# EAGLE design driver1 (EAGLE 7.3.0)
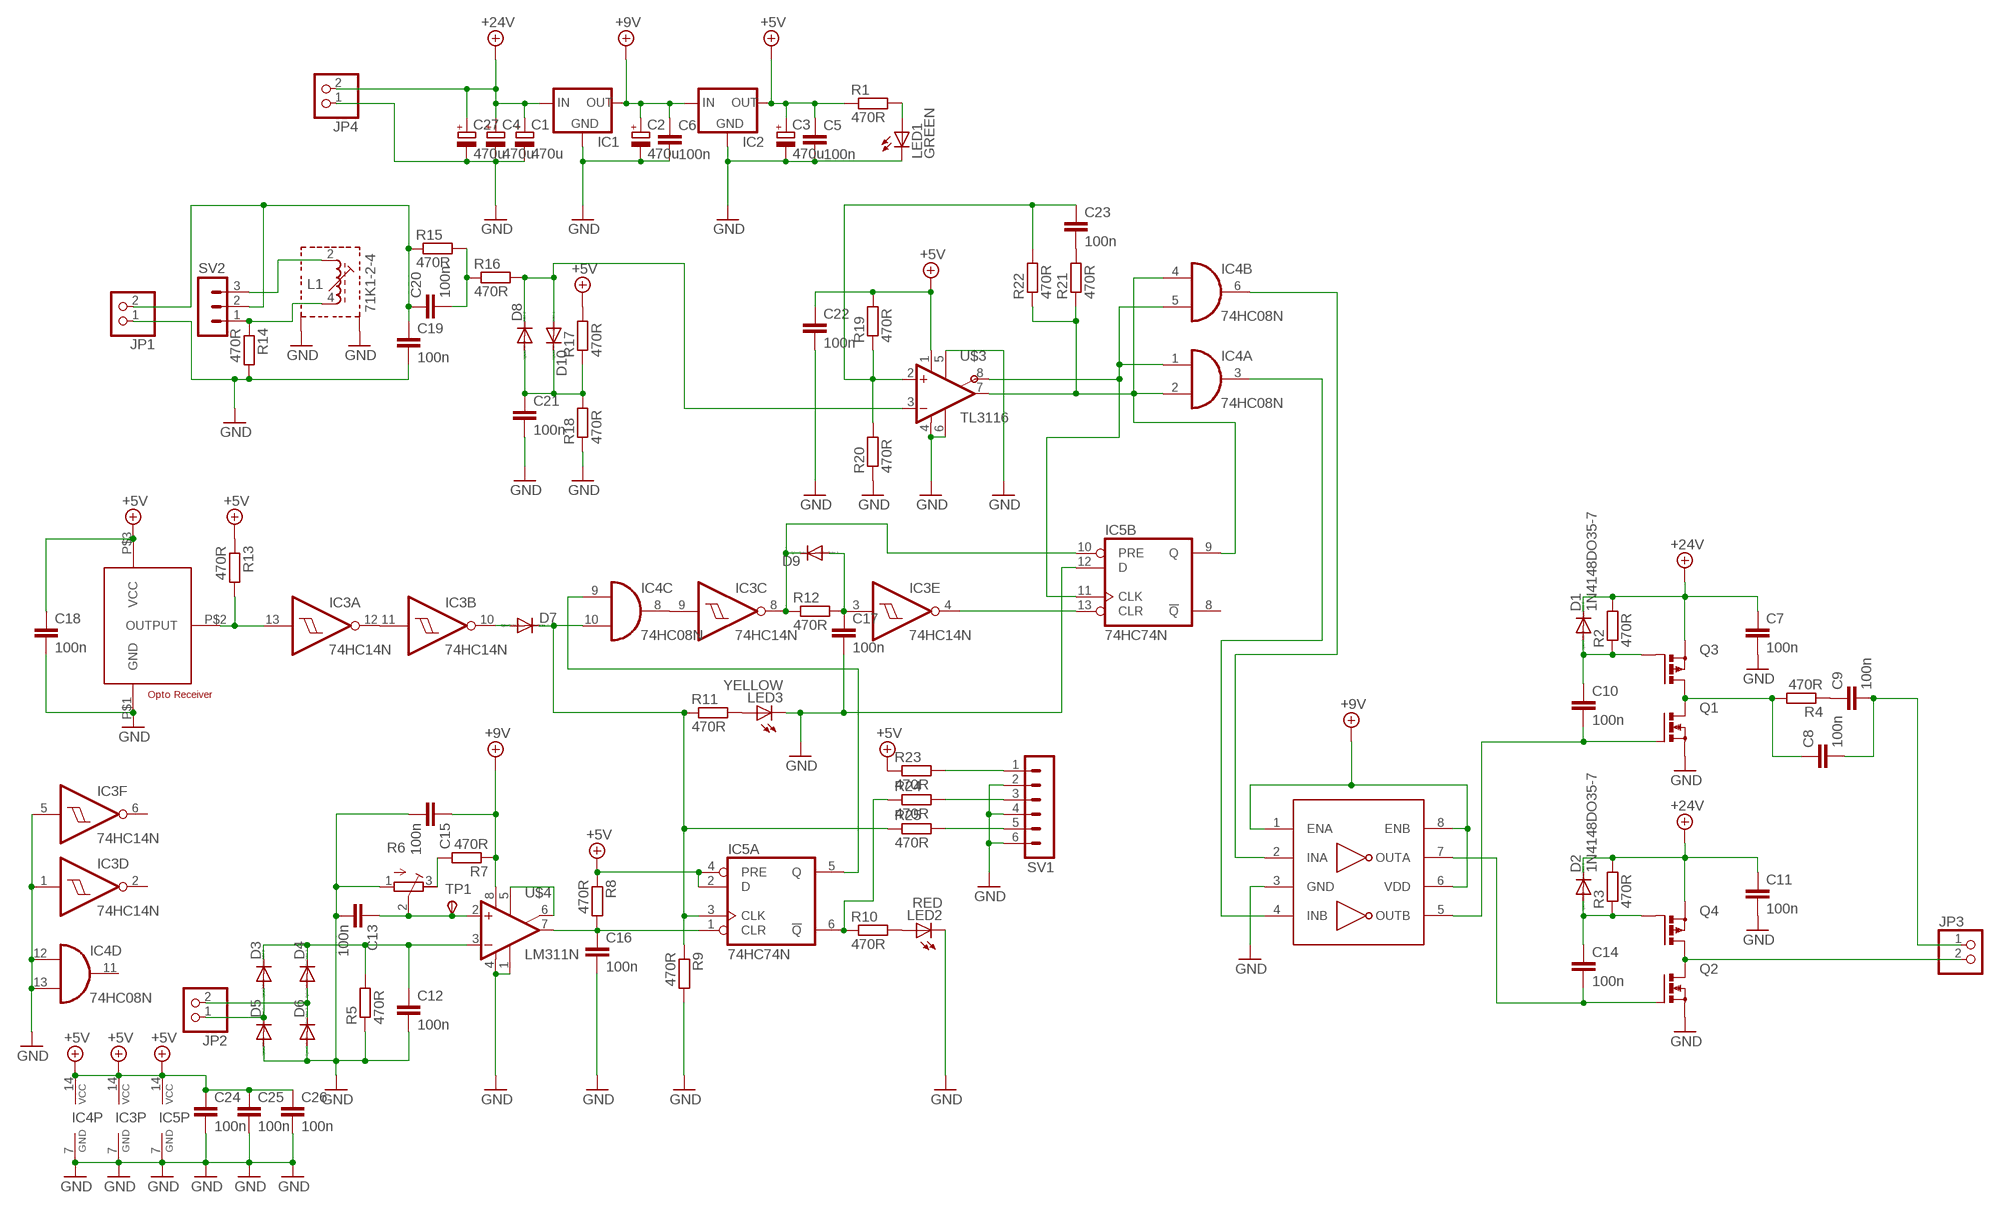
[diagram p0: schematic, sheet 1]

## Parts
C1  470u  CPOL-EUE5-8.5  [E5-8,5]
C2  470u  CPOL-EUE5-8.5  [E5-8,5]
C3  470u  CPOL-EUE5-8.5  [E5-8,5]
C4  470u  CPOL-EUE5-8.5  [E5-8,5]
C5  100n  C-EU025-025X050  [C025-025X050]
C6  100n  C-EU025-025X050  [C025-025X050]
C7  100n  C-EU025-025X050  [C025-025X050]
C8  100n  C-EU025-025X050  [C025-025X050]
C9  100n  C-EU025-025X050  [C025-025X050]
C10  100n  C-EU025-025X050  [C025-025X050]
C11  100n  C-EU025-025X050  [C025-025X050]
C12  100n  C-EU025-025X050  [C025-025X050]
C13  100n  C-EU025-025X050  [C025-025X050]
C14  100n  C-EU025-025X050  [C025-025X050]
C15  100n  C-EU025-025X050  [C025-025X050]
C16  100n  C-EU025-025X050  [C025-025X050]
C17  100n  C-EU025-025X050  [C025-025X050]
C18  100n  C-EU025-025X050  [C025-025X050]
C19  100n  C-EU025-025X050  [C025-025X050]
C20  100n  C-EU025-025X050  [C025-025X050]
C21  100n  C-EU025-025X050  [C025-025X050]
C22  100n  C-EU025-025X050  [C025-025X050]
C23  100n  C-EU025-025X050  [C025-025X050]
C24  100n  C-EU025-025X050  [C025-025X050]
C25  100n  C-EU025-025X050  [C025-025X050]
C26  100n  C-EU025-025X050  [C025-025X050]
C27  470u  CPOL-EUE5-8.5  [E5-8,5]
D1  1N4148DO35-7  [DO35-7]
D2  1N4148DO35-7  [DO35-7]
D3  DIODE-D-7.5  [D-7.5]
D4  DIODE-D-7.5  [D-7.5]
D5  DIODE-D-7.5  [D-7.5]
D6  DIODE-D-7.5  [D-7.5]
D7  DIODE-D-7.5  [D-7.5]
D8  DIODE-D-7.5  [D-7.5]
D9  DIODE-D-7.5  [D-7.5]
D10  DIODE-D-7.5  [D-7.5]
IC1  78XXS  [78XXS]
IC2  78XXS  [78XXS]
IC3  74HC14N  [DIL14]
IC4  74HC08N  [DIL14]
IC5  74HC74N  [DIL14]
JP1  PINHD-1X2  [1X02]
JP2  PINHD-1X2  [1X02]
JP3  PINHD-1X2  [1X02]
JP4  PINHD-1X2  [1X02]
L1  71K1-2-4  [71K]
LED1  GREEN  LED3MM  [LED3MM]
LED2  RED  LED3MM  [LED3MM]
LED3  YELLOW  LED3MM  [LED3MM]
Q1  PMOSFET_NTO220BV  [TO220BV]
Q2  PMOSFET_NTO220BV  [TO220BV]
Q3  PMOSFET_PTO220BV  [TO220BV]
Q4  PMOSFET_PTO220BV  [TO220BV]
R1  470R  R-EU_0207/7  [0207/7]
R2  470R  R-EU_0207/7  [0207/7]
R3  470R  R-EU_0207/7  [0207/7]
R4  470R  R-EU_0207/7  [0207/7]
R5  470R  R-EU_0309/12  [0309/12]
R6  R-TRIMM64W  [RTRIM64W]
R7  470R  R-EU_0207/7  [0207/7]
R8  470R  R-EU_0207/7  [0207/7]
R9  470R  R-EU_0207/7  [0207/7]
R10  470R  R-EU_0207/7  [0207/7]
R11  470R  R-EU_0207/7  [0207/7]
R12  470R  R-EU_0207/7  [0207/7]
R13  470R  R-EU_0207/7  [0207/7]
R14  470R  R-EU_0207/7  [0207/7]
R15  470R  R-EU_0207/7  [0207/7]
R16  470R  R-EU_0207/7  [0207/7]
R17  470R  R-EU_0207/7  [0207/7]
R18  470R  R-EU_0207/7  [0207/7]
R19  470R  R-EU_0207/7  [0207/7]
R20  470R  R-EU_0207/7  [0207/7]
R21  470R  R-EU_0207/7  [0207/7]
R22  470R  R-EU_0207/7  [0207/7]
R23  470R  R-EU_0207/7  [0207/7]
R24  470R  R-EU_0207/7  [0207/7]
R25  470R  R-EU_0207/7  [0207/7]
SV1  MA06-1  [MA06-1]
SV2  MA03-1  [MA03-1]
TP1  TPSTP20R  [TP20R]
U$1  UCC27423  [DIL8]
U$2  IFD95  [OPTO-RECEIVER]
U$3  TL3116  [DIL8]
U$4  LM311N  [DIL8]

## Nets
+5V: C3.+ C5.1 C18.1 C22.1 C24.1 C25.1 C26.1 IC2.OUT IC3.14(P:VCC) IC4.14(P:VCC) IC5.2(A:D) IC5.4(A:PRE) IC5.14(P:VCC) R1.1 R8.1 R13.1 R17.2 R19.2 R23.1 U$2.P$3(VCC) U$3.1(V+)
+9V: C2.+ C6.1 C15.1 IC1.OUT IC2.IN R7.1 U$1.1(ENA) U$1.6(VDD) U$1.8(ENB) U$4.8(V+)
+24V: C1.+ C4.+ C7.1 C11.1 C27.+ D1.C D2.C IC1.IN JP4.2 Q3.S Q4.S R2.2 R3.2
GND: C1.- C2.- C3.- C4.- C5.2 C6.2 C7.2 C11.2 C12.2 C13.2 C15.2 C16.2 C17.2 C18.2 C19.2 C21.2 C22.2 C24.2 C25.2 C26.2 C27.- D5.A D6.A IC1.GND IC2.GND IC3.1(D:I) IC3.5(F:I) IC3.7(P:GND) IC4.7(P:GND) IC4.12(D:I0) IC4.13(D:I1) IC5.7(P:GND) IC5.12(B:D) JP1.1 JP4.1 L1.S1 L1.S2 LED1.K(C) LED2.K(C) LED3.K(C) Q1.S Q2.S R5.1 R6.1(A) R9.2 R14.2 R18.1 R20.1 SV1.2 SV1.4 SV1.6 U$1.3(GND) U$2.P$1(GND) U$3.4(V-) U$3.5(LEN) U$3.6(GND) U$4.1(GND) U$4.4(V-)
N$1: IC3.11(B:I) IC3.12(A:O)
N$2: LED1.A R1.2
N$3: IC3.9(C:I) IC4.8(C:O)
N$4: C8.1 Q1.D Q3.D R4.2
N$5: U$4.5(ON) U$4.6(ON/STR)
N$6: C10.1 D1.A Q3.G R2.1
N$7: IC4.2(A:I1) IC4.4(B:I0) IC5.9(B:Q) R21.1 R22.1 U$3.7(OUT)
N$8: C9.1 R4.1
N$9: C8.2 C9.2 JP3.1
N$10: C14.1 D2.A Q4.G R3.1
N$11: IC4.6(B:O) U$1.2(INA)
N$12: JP3.2 Q2.D Q4.D
N$13: C16.1 IC5.1(A:CLR) R8.2 U$4.7(OUT)
N$14: R6.3(E) R7.2
N$15: R23.2 SV1.1
N$16: R24.2 SV1.3
N$17: IC4.3(A:O) U$1.4(INB)
N$18: R25.2 SV1.5
N$19: C13.1 R6.2(S) TP1.TP(PP) U$4.2(+IN)
N$20: C12.1 D3.C D4.C R5.2 U$4.3(-IN)
N$22: D9.C IC3.8(C:O) IC5.10(B:PRE) R12.1
N$23: D3.A D5.C JP2.1
N$24: D4.A D6.C JP2.2
N$25: D7.C IC4.10(C:I1) IC5.3(A:CLK) R9.1 R11.1 R25.1
N$26: IC3.13(A:I) R13.2 U$2.P$2(OUTPUT)
N$27: D7.A IC3.10(B:O)
N$28: IC5.6(A:!Q) R10.1 R24.1
N$29: LED2.A R10.2
N$30: LED3.A R11.2
N$31: IC4.9(C:I0) IC5.5(A:Q)
N$32: C17.1 D9.A IC3.3(E:I) R12.2
N$33: IC3.4(E:O) IC5.13(B:CLR)
N$34: IC4.1(A:I0) IC4.5(B:I1) IC5.11(B:CLK) U$3.8(!OUT)
N$35: C19.1 C20.1 JP1.2 R15.1 SV2.2
N$36: C14.2 Q2.G U$1.7(OUTA)
N$37: C20.2 R15.2 R16.1
N$38: L1.4(E) R14.1 SV2.1
N$39: L1.2(A) SV2.3
N$40: D8.C D10.A R16.2 U$3.3(-IN)
N$41: C21.1 D8.A D10.C R17.1 R18.2
N$42: C10.2 Q1.G U$1.5(OUTB)
N$46: C23.2 R21.2
N$47: C23.1 R19.1 R20.2 R22.2 U$3.2(+IN)
Unconnected: IC3.2(D:O) IC3.6(F:O) IC4.11(D:O) IC5.8(B:!Q)

## Library data of the parts
C1-C4 C27 = rcl:CPOL-EU: POLARIZED CAPACITOR, European symbol
C5-C26 = rcl:C-EU: CAPACITOR, European symbol
D1 D2 = diode:1N4148: DIODE high speed (Philips)
D3-D10 = diode:DIODE-: DIODE
IC1 IC2 = v-reg:78XXS: VOLTAGE REGULATOR
IC3 = 74xx-eu:74*14: Hex schmitt trigger INVERTER
IC4 = 74xx-eu:74*08: Quad 2-input AND gate
IC5 = 74xx-eu:74*74: Dual D type positive edge triggered FLIP FLOP, preset and clear
JP1-JP4 = pinhead:PINHD-1X2: PIN HEADER
L1 = UD27:71K1-: FILTER adjustable filter coil, type K; OC_FARNELL: unknown; OC_NEWARK: unknown
LED1-LED3 = led:LED: LED OSRAM: - CHIPLED LG R971, LG N971, LY N971, LG Q971, LY Q971, LO R971, LY R971 LH N974, LH R974 LS Q976, LO Q976, LY Q976 LO Q996 - Hyper CHIPLED LW Q18S LB Q993, LB Q99A, LB R99A - SideLED LS A670, LO A670, LY A670, LG A670, LP A670 LB A673, LV A673, LT A673, LW A673 LH A674 LY A675 LS A676, LA A676, LO A676, LY A676, LW A676 LS A679, LY A679, LG A679 - Hyper Micro SIDELED® LS Y876, LA Y876, LO Y876, LY Y876 LT Y87S - SmartLED LW L88C, LW L88S LB L89C, LB L89S, LG L890 LS L89K, LO L89K, LY L89K LS L896, LA L896, LO L896, LY L896 - TOPLED LS T670, LO T670, LY T670, LG T670, LP T670 LSG T670, LSP T670, LSY T670, LOP T670, LYG T670 LG T671, LOG T671, LSG T671 LB T673, LV T673, LT T673, LW T673 LH T674 LS T676, LA T676, LO T676, LY T676, LB T676, LH T676, LSB T676, LW T676 LB T67C, LV T67C, LT T67C, LS T67K, LO T67K, LY T67K, LW E67C LS E67B, LA E67B, LO E67B, LY E67B, LB E67C, LV E67C, LT E67C LW T67C LS T679, LY T679, LG T679 LS T770, LO T770, LY T770, LG T770, LP T770 LB T773, LV T773, LT T773, LW T773 LH T774 LS E675, LA E675, LY E675, LS T675 LS T776, LA T776, LO T776, LY T776, LB T776 LHGB T686 LT T68C, LB T68C - Hyper Mini TOPLED® LB M676 - Mini TOPLED Santana® LG M470 LS M47K, LO M47K, LY M47K Source: http://www.osram.convergy.de LUXEON: - LUMILED® LXK2-PW12-R00, LXK2-PW12-S00, LXK2-PW14-U00, LXK2-PW14-V00 LXK2-PM12-R00, LXK2-PM12-S00, LXK2-PM14-U00 LXK2-PE12-Q00, LXK2-PE12-R00, LXK2-PE12-S00, LXK2-PE14-T00, LXK2-PE14-U00 LXK2-PB12-K00, LXK2-PB12-L00, LXK2-PB12-M00, LXK2-PB14-N00, LXK2-PB14-P00, LXK2-PB14-Q00 LXK2-PR12-L00, LXK2-PR12-M00, LXK2-PR14-Q00, LXK2-PR14-R00 LXK2-PD12-Q00, LXK2-PD12-R00, LXK2-PD12-S00 LXK2-PH12-R00, LXK2-PH12-S00 LXK2-PL12-P00, LXK2-PL12-Q00, LXK2-PL12-R00 Source: www.luxeon.com KINGBRIGHT: KA-3528ASYC Source: www.kingbright.com
Q1 Q2 = transistor-power:PMOSFET_N: Power MOSFET N-Channel
Q3 Q4 = transistor-power:PMOSFET_P: Power MOSFET P-Channel
R1-R5 R7-R25 = rcl:R-EU_: RESISTOR, European symbol
R6 = rcl:R-TRIMM: Trimm resistor
SV1 = con-lstb:MA06-1: PIN HEADER; OC_FARNELL: unknown; OC_NEWARK: unknown
SV2 = con-lstb:MA03-1: PIN HEADER; OC_FARNELL: unknown; OC_NEWARK: unknown
TP1 = testpad:TPS: TEST PIN
U$1 = driver:UCC27423
U$2 = BillPorter:IFD95: IF-D95T Photologic Detector with Totem-Pole Output. Fiber Optic Receiver with push-pull output. May also work with IF-D97 and IF-D98 receivers. Spec sheet @ http://www.i-fiberoptics.com/pdf/IFD95.pdf
U$3 = driver:TL3116
U$4 = driver:LM311N

## Board
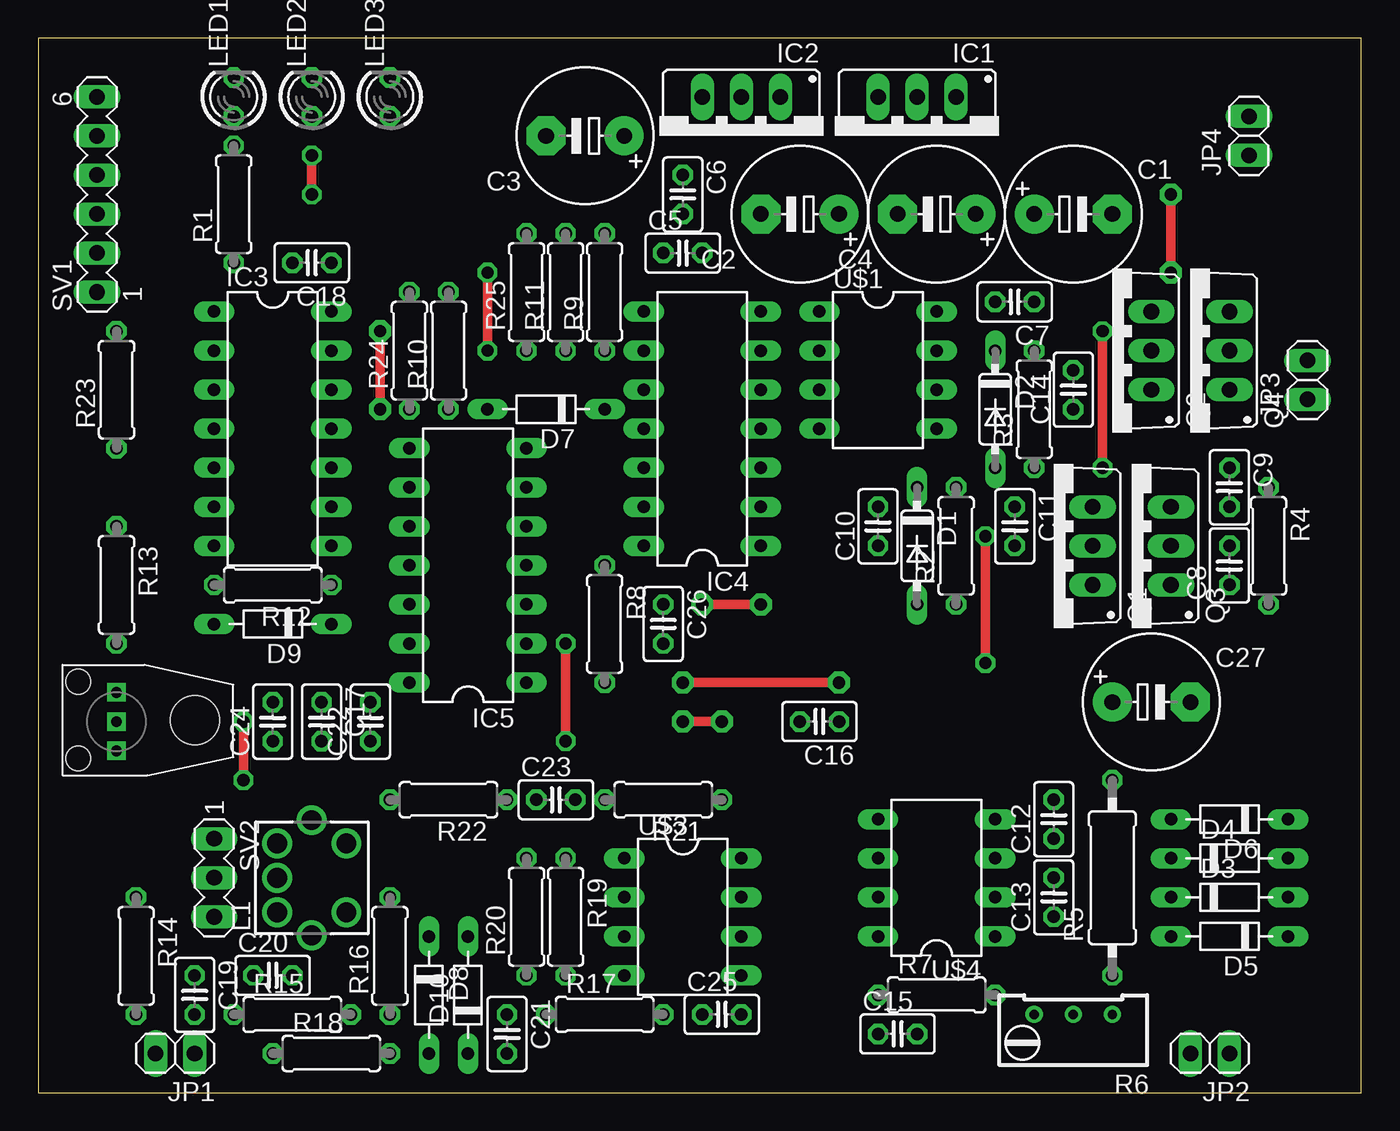
[diagram p1: board, top side]
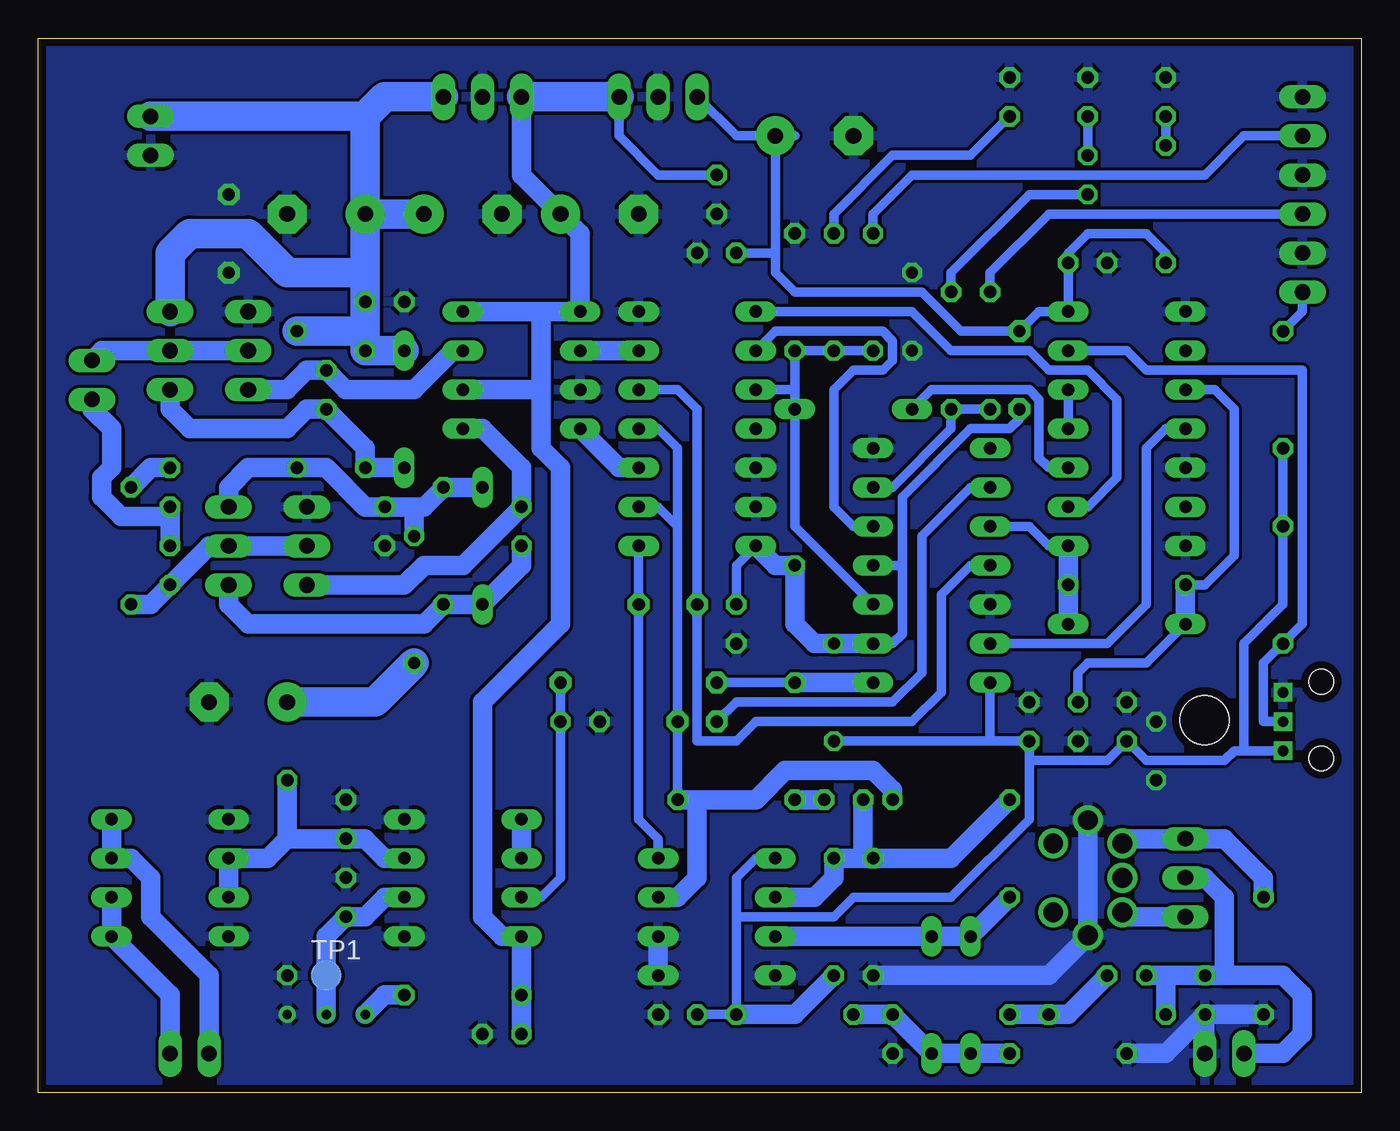
[diagram p2: board, bottom side, seen from below]

Size 86.03 x 68.57 mm. Coordinates in mm from the lower left corner, seen from the top.
Outline: 0,0 86.03,0 86.03,68.57 0,68.57 0,0
Copper layers (1*16): Top 0.035mm / dielectric 1.5mm / Bottom 0.035mm
Design rules "default *": minimum track width 10mil, minimum drill 24mil, track to track 8mil, track to pad 8mil, pad to pad 8mil, via to via 8mil, smd to smd 8mil, copper to edge 20mil, drill to drill 8mil, minimum pad ring 10mil, minimum via ring 8mil, stop-mask expansion 4mil, vias tented up to drill 0mil, thermal gap 10mil

### Footprints (pad centres in the part's own frame; a part is rotated, then mirrored left to right if it is on the bottom)
E5-8,5 = drill 1.016 pad 2.54: + -2.54,0 | drill 1.016 pad 2.54 octagon: - 2.54,0
C025-025X050 = drill 0.813 octagon: 1 -1.27,0; 2 1.27,0
DO35-7 = drill 0.813 long: A 3.81,0; C -3.81,0
D-7.5 = drill 0.813 long: A 3.81,0; C -3.81,0
78XXS = drill 1.016 long: GND 0,-2.54; IN -2.54,-2.54; OUT 2.54,-2.54
DIL14 = drill 0.813 long: 1 -7.62,-3.81; 2 -5.08,-3.81; 3 -2.54,-3.81; 4 0,-3.81; 5 2.54,-3.81; 6 5.08,-3.81; 7 7.62,-3.81; 8 7.62,3.81; 9 5.08,3.81; 10 2.54,3.81; 11 0,3.81; 12 -2.54,3.81; 13 -5.08,3.81; 14 -7.62,3.81
1X02 = drill 1.016 long: 1 -1.27,0; 2 1.27,0
71K = drill 1.3: 1 -2.25,-2.25; 2 -2.25,2.25; 3 0,2.25; 4 2.25,2.25; 5 2.25,-2.25; S1 -3.75,0; S2 3.75,0
LED3MM = drill 0.813 octagon: A -1.27,0; K 1.27,0
TO220BV = drill 1.016 long: D 0,-2.54; G -2.54,-2.54; S 2.54,-2.54
0207/7 = drill 0.813 octagon: 1 -3.81,0; 2 3.81,0
0309/12 = drill 0.813 octagon: 1 -6.35,0; 2 6.35,0
RTRIM64W = drill 0.61: 1 1.27,-2.54; 2 1.27,0; 3 1.27,2.54
MA06-1 = drill 1.016 long: 1 -6.35,0; 2 -3.81,0; 3 -1.27,0; 4 1.27,0; 5 3.81,0; 6 6.35,0
MA03-1 = drill 1.016 long: 1 -2.54,0; 2 0,0; 3 2.54,0
TP20R = smd 2 x 2: TP 0,0
DIL8 = drill 0.813 long: 1 -3.81,-3.81; 2 -1.27,-3.81; 3 1.27,-3.81; 4 3.81,-3.81; 5 3.81,3.81; 6 1.27,3.81; 7 -1.27,3.81; 8 -3.81,3.81
OPTO-RECEIVER = drill 0.7 square: P$1 1.9,0; P$2 0,0; P$3 -1.9,0 | hole 1.6: -2.4,2.5; 2.6,2.5 | hole 3.2: 0.1,-5.1

### Placement (x,y rotation side)
C1  67.31,57.15 0 top
C2  49.53,57.15 180 top
C3  35.56,62.23 180 top
C4  58.42,57.15 180 top
C5  41.91,54.61 0 top
C6  41.91,58.42 270 top
C7  63.5,51.44 180 top
C8  77.47,34.29 90 top
C9  77.47,39.37 270 top
C10  54.61,36.83 90 top
C11  63.5,36.83 270 top
C12  66.04,17.78 90 top
C13  66.04,12.7 90 top
C14  67.31,45.72 90 top
C15  55.88,3.81 0 top
C16  50.8,24.13 180 top
C17  18.41,24.13 270 top
C18  17.78,53.98 180 top
C19  10.16,6.35 270 top
C20  15.24,7.62 0 top
C21  30.48,3.81 270 top
C22  21.59,24.13 90 top
C23  33.66,19.05 0 top
C24  15.24,24.13 90 top
C25  44.45,5.08 0 top
C26  40.64,30.48 270 top
C27  72.39,25.4 0 top
D1  57.15,35.56 270 top
D2  62.23,44.45 270 top
D3  77.47,12.7 0 top
D4  77.47,15.24 0 top
D5  77.47,10.16 180 top
D6  77.47,17.78 180 top
D7  33.02,44.45 180 top
D8  25.4,6.35 270 top
D9  15.24,30.48 180 top
D10  27.94,6.35 90 top
IC1  57.15,62.23 180 top
IC2  45.72,62.23 180 top
IC3  15.24,43.18 270 top
IC4  43.18,43.18 90 top
IC5  27.94,34.29 90 top
JP1  8.89,2.54 180 top
JP2  76.2,2.54 180 top
JP3  82.55,46.35 90 top
JP4  78.74,62.23 90 top
L1  17.78,13.97 90 top
LED1  12.7,64.77 90 top
LED2  17.78,64.77 90 top
LED3  22.86,64.77 90 top
Q1  66.04,35.56 90 top
Q2  69.85,48.26 90 top
Q3  71.12,35.56 90 top
Q4  74.93,48.26 90 top
R1  12.7,57.78 90 top
R2  59.69,35.56 90 top
R3  64.77,44.45 90 top
R4  80.01,35.56 270 top
R5  69.85,13.97 90 top
R6  67.31,3.81 90 top
R7  58.42,6.35 0 top
R8  36.83,30.48 270 top
R9  36.83,52.07 90 top
R10  26.67,48.26 90 top
R11  34.29,52.07 90 top
R12  15.24,33.02 180 top
R13  5.08,33.02 270 top
R14  6.35,8.89 270 top
R15  16.51,5.08 0 top
R16  22.86,8.89 90 top
R17  36.83,5.08 0 top
R18  19.05,2.54 0 top
R19  34.29,11.43 270 top
R20  31.75,11.43 90 top
R21  40.64,19.05 180 top
R22  26.67,19.05 180 top
R23  5.08,45.72 90 top
R24  24.13,48.26 90 top
R25  31.75,52.07 90 top
SV1  3.81,58.42 90 top
SV2  11.43,13.97 270 top
TP1  67.31,7.62 0 bottom
U$1  54.61,46.99 270 top
U$2  5.08,24.13 90 top
U$3  41.91,11.43 270 top
U$4  58.42,13.97 90 top

### Tracks (layer width: path | path; a pad name or v marks a point on that pad's centre or on a via)
+5V  (via drill 0.8 pad 1.27, 0.8 pad 1.42)
  Top 0.61: v22.23,49.53 v22.23,44.45 | v34.29,22.86 v34.29,29.21
  Bottom 0.61: 40.64,11.43 R17.2 C25.1 | 40.64,11.43 34.29,11.43 33.02,12.7 26.67,12.7 21.59,17.78 21.59,21.59 | U$3.1 39.37,15.24 40.64,13.97 40.64,11.43 | IC5.4 29.84,34.29 | 29.84,34.29 29.84,29.84 30.48,29.21 IC5.2 | 29.84,34.29 29.84,38.73 25.4,43.18 22.86,43.18 22.23,43.81 v22.23,44.45 | 36.83,62.23 C3.+ | C3.+ 40.64,62.23 IC2.OUT | 38.1,54.61 38.1,53.34 36.83,52.07 28.57,52.07 26.04,49.53 v22.23,49.53 20.95,50.8 IC3.14 C18.1 19.05,54.61 17.78,55.88 13.97,55.88 12.7,54.61 R1.1 | 21.59,21.59 C22.1 24.13,22.86 | C26.1 40.64,34.29 IC4.14 | C5.1 38.1,54.61 | 24.13,22.86 v34.29,22.86 | IC5.14 24.13,22.86 | U$2.P$3 7.62,22.23 | 7.62,22.23 8.25,22.23 8.89,21.59 13.97,21.59 C24.1 16.51,21.59 21.59,21.59 | 7.62,22.23 7.62,29.21 5.08,31.75 R13.1 R23.1 | 38.1,54.61 C3.+
  Bottom 1.27: R19.2 36.83,5.08 R17.2 | IC4.14 38.1,34.29 R8.1 36.83,30.48 35.56,29.21 v34.29,29.21 IC5.2
+9V
  Bottom 0.61: C6.1 45.72,59.69 48.26,62.23 IC2.IN
  Bottom 1.27: C15.1 R7.1 U$4.8 55.88,10.16 57.15,11.43 57.15,25.4 52.07,30.48 52.07,40.64 53.34,41.91 53.34,45.72 | 53.34,50.8 U$1.1 50.8,55.88 C2.+ 54.61,59.69 IC1.OUT | 53.34,50.8 U$1.8 | U$1.6 53.34,45.72 | 53.34,45.72 53.34,50.8
  Bottom 1.93: IC1.OUT IC2.IN
+24V  (via drill 0.8 pad 1.27)
  Top 0.61: v69.22,40.64 v69.22,49.53 | v61.59,27.94 v61.59,36.2
  Bottom 1.27: D1.C R2.2 60.96,38.1 61.59,38.1 | Q3.S 73.66,39.37 72.39,40.64 v69.22,40.64 67.31,40.64 64.77,38.1 C11.1 61.59,38.1 | v61.59,36.2 61.59,38.1
  Bottom 1.93: JP4.2 64.77,63.5 | 64.77,63.5 63.5,64.77 IC1.IN | Q4.S 77.47,54.61 76.2,55.88 72.39,55.88 69.85,53.34 64.77,53.34 | C4.+ C1.+ | 64.77,63.5 C1.+ | C1.+ 64.77,53.34 | 64.77,53.34 C7.1 64.77,49.53 | 64.77,49.53 R3.2 D2.C | v69.22,49.53 64.77,49.53 | C27.+ 64.14,25.4 v61.59,27.94
GND  (via drill 0.8 pad 1.27, 0.8 pad 1.42)
  Top 0.61: v73.66,53.34 v73.66,58.42 | v13.34,24.13 v13.34,20.32 | v29.21,48.26 v29.21,53.34
  Bottom 1.27: L1.S2 L1.S1 17.78,10.16 20.32,7.62 R20.1 | U$3.6 U$3.5 | C19.2 12.7,2.54 R18.1 | R14.2 C19.2 | JP1.1 C19.2
  pour Bottom: 0,0 86.36,0 86.36,68.58 0,68.58
N$1
  Bottom 0.61: IC3.12 IC3.11
N$2
  Bottom 0.61: R1.2 LED1.A
N$3
  Bottom 0.61: IC4.8 29.21,50.8 26.67,48.26 21.59,48.26 20.32,46.99 17.78,46.99 15.88,45.09 15.88,40.01 17.78,38.1 IC3.9
N$4
  Bottom 1.27: Q1.D Q3.D 74.93,35.56 C8.1 78.74,31.75 R4.2
N$5
  Bottom 1.27: U$4.5 U$4.6
N$6
  Bottom 1.27: C10.1 54.61,34.29 D1.A R2.1 60.96,30.48 72.39,30.48 73.66,31.75 Q3.G
N$7  (via drill 0.8 pad 1.42)
  Top 0.61: v41.91,24.13 v44.45,24.13
  Bottom 0.61: 44.45,36.83 45.72,38.1 IC4.2 | IC4.4 45.72,43.18 44.45,41.91 44.45,36.83 | IC5.9 25.4,39.37 28.57,36.2 28.57,27.3 30.48,25.4 40.64,25.4 v41.91,24.13 | R21.1 v44.45,24.13 44.45,36.83
  Bottom 1.27: U$3.7 44.45,12.7 43.18,13.97 43.18,19.05 | 43.18,19.05 R21.1 | R22.1 30.48,19.68 31.75,20.95 37.47,20.95 39.37,19.05 43.18,19.05
N$8
  Bottom 1.27: C9.1 78.74,40.64 R4.1
N$9
  Bottom 1.27: C8.2 77.47,37.47 | 77.47,37.47 C9.2 | JP3.1 82.55,44.45 81.28,43.18 81.28,40.64 81.92,40.01 81.92,38.73 80.64,37.47 77.47,37.47
N$10
  Bottom 1.27: D2.A R3.1 64.77,41.91 C14.1 68.58,44.45 69.85,43.18 76.2,43.18 77.47,44.45 Q4.G
N$11
  Bottom 1.27: U$1.2 IC4.6
N$12
  Bottom 1.27: Q2.D Q4.D 81.92,48.26 JP3.2
N$13  (via drill 0.8 pad 1.42)
  Top 0.61: v41.91,26.67 v52.07,26.67
  Bottom 0.61: R8.2 v41.91,26.67 | U$4.7 53.34,12.7 52.07,13.97 C16.1 v52.07,26.67
  Bottom 1.27: R8.2 IC5.1
N$14
  Bottom 1.27: R7.2 63.5,6.35 R6.3
N$15
  Bottom 0.61: SV1.1 3.81,50.8 R23.2
N$16
  Bottom 0.61: SV1.3 20.32,57.15 24.13,53.34 R24.2
N$17
  Bottom 1.27: U$1.4 48.26,40.64 IC4.3
N$18
  Bottom 0.61: R25.2 31.75,57.15 29.21,59.69 10.16,59.69 7.62,62.23 SV1.5
N$19
  Bottom 1.27: U$4.2 63.5,12.7 64.77,11.43 C13.1 67.31,10.16 TP1.TP R6.2
N$20
  Bottom 1.27: D3.C D4.C 71.12,15.24 69.85,16.51 | 69.85,16.51 R5.2 | U$4.3 63.5,15.24 64.77,16.51 C12.1 69.85,16.51
N$22
  Bottom 0.61: IC3.8 20.32,35.56 21.59,36.83 IC5.10
  Bottom 1.27: D9.C R12.1 IC3.8
N$23
  Bottom 1.27: D3.A D5.C 77.47,6.35 JP2.1
N$24
  Bottom 1.27: D6.C D4.A 80.01,15.24 78.74,13.97 78.74,11.43 74.93,7.62 JP2.2
N$25
  Bottom 0.61: 36.83,45.72 D7.C 36.83,36.83 IC5.3 | 36.83,45.72 R9.1 R11.1 R25.1 | IC4.10 36.83,45.72
N$26
  Bottom 0.61: IC3.13 15.24,48.26 13.97,46.99 3.81,46.99 3.81,30.48 R13.2 6.35,27.94 6.35,24.13 U$2.P$2
N$27
  Bottom 0.61: IC3.10 20.32,40.64 20.95,41.27 20.95,45.09 21.59,45.72 27.94,45.72 D7.A
N$28
  Bottom 0.61: IC5.6 30.48,39.37 26.67,43.18 R10.1 R24.1
N$29  (via drill 0.8 pad 1.27)
  Top 0.61: v17.78,58.42 v17.78,60.96
  Bottom 0.61: R10.2 26.67,53.34 21.59,58.42 v17.78,58.42 | v17.78,60.96 LED2.A
N$30
  Bottom 0.61: R11.2 34.29,57.15 30.48,60.96 25.4,60.96 LED3.A
N$31
  Bottom 0.61: IC4.9 38.1,49.53 31.11,49.53 30.48,48.9 30.48,47.62 31.11,46.99 33.02,46.99 34.29,45.72 34.29,38.1 33.02,36.83 IC5.5
N$32
  Bottom 0.61: R12.2 10.16,33.02 8.26,34.92 8.26,44.45 9.53,45.72 IC3.3 | C17.1 18.41,27.3 17.78,27.94 13.97,27.94 D9.A
  Bottom 1.27: D9.A R12.2
N$33
  Bottom 0.61: IC5.13 16.51,29.21 13.97,31.75 13.97,41.91 12.7,43.18 IC3.4
N$34  (via drill 0.8 pad 1.42)
  Top 0.61: v43.18,31.75 v46.99,31.75
  Bottom 0.61: IC5.11 25.4,34.29 27.3,32.38 27.3,26.04 29.21,24.13 39.37,24.13 40.64,22.86 43.18,22.86 v43.18,31.75 43.18,44.45 44.45,45.72 IC4.5 | IC4.1 v46.99,31.75 46.99,17.78 45.72,16.51 U$3.8
N$35
  Bottom 1.27: 8.89,7.62 C19.1 12.7,7.62 | 12.7,7.62 C20.1 | R15.1 12.7,7.62 | SV2.2 10.16,13.97 8.89,12.7 8.89,7.62 | 8.89,7.62 5.08,7.62 3.81,6.35 3.81,3.81 5.08,2.54 JP1.2
N$36
  Bottom 1.27: Q2.G 69.85,45.72 68.58,46.99 C14.2 66.04,45.72 61.59,45.72 59.05,48.26 U$1.7
N$37
  Bottom 1.27: C20.2 19.05,5.08 R15.2 R16.1
N$38
  Bottom 1.27: L1.4 15.24,16.51 SV2.1 8.89,16.51 6.35,13.97 R14.1
N$39
  Bottom 1.27: SV2.3 15.24,11.43 L1.2
N$40
  Bottom 1.27: R16.2 D8.C D10.A U$3.3
N$41
  Bottom 1.27: R18.2 D8.A D10.C C21.1 R17.1
N$42
  Bottom 1.27: U$1.5 57.15,43.18 54.61,40.64 C10.2 58.42,34.29 60.96,34.29 62.23,33.02 Q1.G
N$46
  Bottom 1.27: R21.2 C23.2
N$47
  Bottom 1.27: U$3.2 35.56,12.7 34.29,13.97 R19.1 32.38,15.24 | 32.38,15.24 R20.2 26.67,15.24 R22.2 | C23.1 32.38,15.24